# EAGLE design BusPSU (EAGLE 5.12)
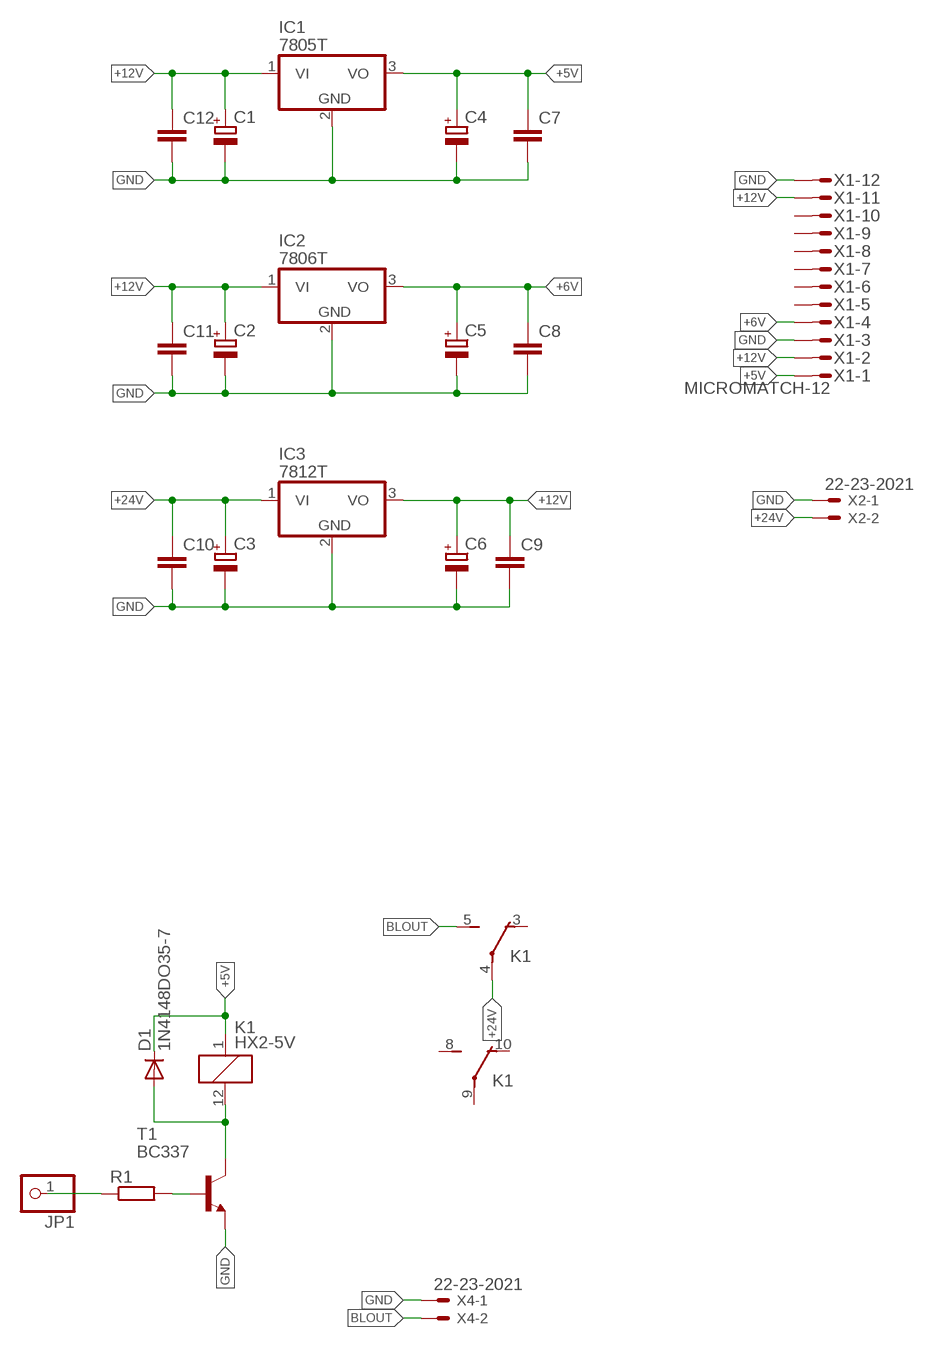
[diagram p0: schematic, sheet 1]

## Parts
C1  CPOL-EUE35-12AXIAL  [E35-12]
C2  CPOL-EUE35-12AXIAL  [E35-12]
C3  CPOL-EUE35-12AXIAL  [E35-12]
C4  CPOL-EUE2-5  [E2-5]
C5  CPOL-EUE2-5  [E2-5]
C6  CPOL-EUE2-5  [E2-5]
C7  C-EU050-025X075  [C050-025X075]
C8  C-EU050-025X075  [C050-025X075]
C9  C-EU050-025X075  [C050-025X075]
C10  C-EU050-025X075  [C050-025X075]
C11  C-EU050-025X075  [C050-025X075]
C12  C-EU050-025X075  [C050-025X075]
D1  1N4148DO35-7  [DO35-7]
IC1  7805T  [TO220H]
IC2  7806T  [TO220H]
IC3  7812T  [TO220H]
JP1  PINHD-1X1  [1X01]
K1  HX2-5V  [HX]
R1  R-EU_0207/10  [0207/10]
T1  BC337  [TO92]
X1  MICROMATCH-12  [MICROMATCH-12]
X2  22-23-2021  [22-23-2021]
X4  22-23-2021  [22-23-2021]

## Nets
+5V: C4.+ C7.1 D1.C IC1.3(VO) K1.1 X1.1
+6V: C5.+ C8.1 IC2.3(VO) X1.4
+12V: C1.+ C2.+ C6.+ C9.1 C11.1 C12.1 IC1.1(VI) IC2.1(VI) IC3.3(VO) X1.2 X1.11
+24V: C3.+ C10.1 IC3.1(VI) K1.4(2:P) X2.2
BLOUT: K1.5(2:S) X4.2
GND: C1.- C2.- C3.- C4.- C5.- C6.- C7.2 C8.2 C9.2 C10.2 C11.2 C12.2 IC1.2(GND) IC2.2(GND) IC3.2(GND) T1.1(E) X1.3 X1.12 X2.1 X4.1
N$1: D1.A K1.12 T1.3(C)
N$3: R1.2 T1.2(B)
N$5: JP1.1 R1.1
Unconnected: K1.3(2:O) K1.8(3:S) K1.9(3:P) K1.10(3:O) X1.5 X1.6 X1.7 X1.8 X1.9 X1.10

## Library data of the parts
C1-C6 = rcl:CPOL-EU: POLARIZED CAPACITOR, European symbol
C7-C12 = rcl:C-EU: CAPACITOR, European symbol
D1 = diode:1N4148: DIODE high speed (Philips)
IC1-IC3 = linear:78*: Positive VOLTAGE REGULATOR Source: http://cache.national.com/ds/LM/LM78L05.pdf http://www.fairchildsemi.com/ds/LM/LM7805.pdf
JP1 = pinhead:PINHD-1X1: PIN HEADER
K1 = relay:HX2-*: Compact & Slim 2 Form C Non-polarized Relay NAiS Source: http://www.mew-europe.com/.. en_ds_61011_0000.pdf; OC_FARNELL: unknown; OC_NEWARK: unknown
R1 = rcl:R-EU_: RESISTOR, European symbol
T1 = transistor:BC337: NPN TRANSISTOR
X1 = con-amp-micromatch:MICROMATCH-12: MicroMaTch 12 8-215464-2 / 1-215464-2 Drawing Number C-215464 DDEController.pdf; MF: FARNELL; MPN: 8-215464-2; OC_FARNELL: 3784666; OC_NEWARK: 95H9857
X2 X4 = con-molex:22-23-2021: .100" (2.54mm) Center Header - 2 Pin; MF: MOLEX; MPN: 22-23-2021; OC_FARNELL: 1462926; OC_NEWARK: 25C3832

## Board
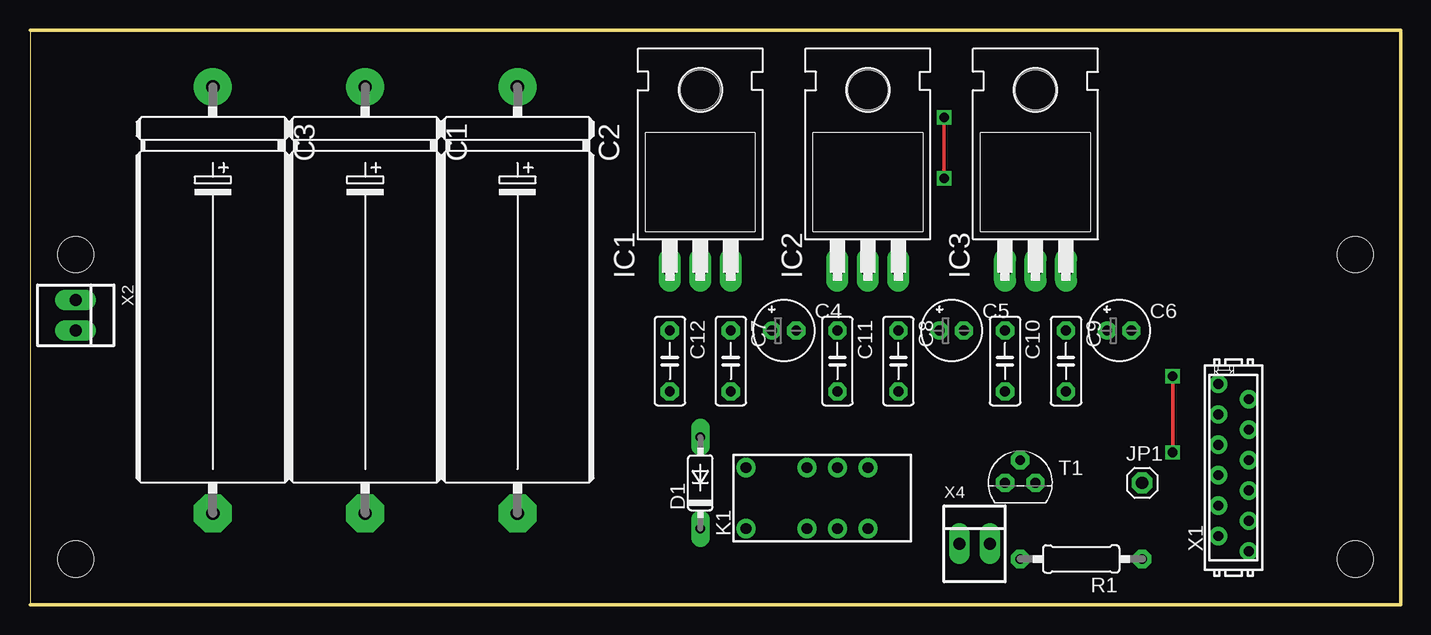
[diagram p1: board, top side]
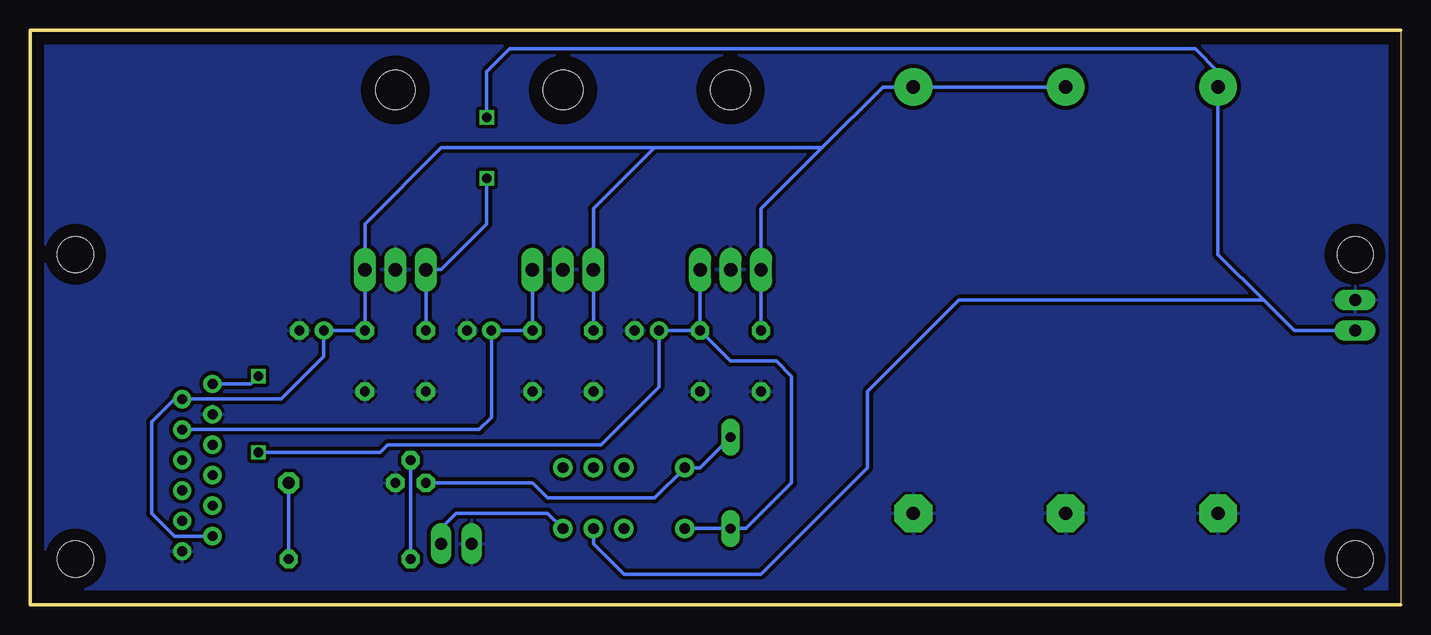
[diagram p2: board, bottom side, seen from below]

Size 114.28 x 47.93 mm. Coordinates in mm from the lower left corner, seen from the top.
Outline: 0,0 114.28,0 114.28,47.93 0,47.93 0,0
Copper layers (1*16): Top 0.035mm / dielectric 1.5mm / Bottom 0.035mm
Design rules "default *": minimum track width 10mil, minimum drill 24mil, track to track 8mil, track to pad 8mil, pad to pad 8mil, via to via 8mil, smd to smd 8mil, copper to edge 40mil, drill to drill 8mil, minimum pad ring 14mil, minimum via ring 8mil, stop-mask expansion 4mil, vias tented up to drill 0mil, thermal gap 10mil
Holes 3 mm at 110.49,29.21 110.49,3.81 3.81,3.81 3.81,29.21

### Footprints (pad centres in the part's own frame; a part is rotated, then mirrored left to right if it is on the bottom)
E35-12 = drill 1.118 pad 3.15 round: + -17.78,0 | drill 1.118 pad 3.15 octagon: - 17.78,0
E2-5 = drill 0.813 pad 1.27 round: + -1.016,0 | drill 0.813 pad 1.27 octagon: - 1.016,0
C050-025X075 = drill 0.813 octagon: 1 -2.54,0; 2 2.54,0
DO35-7 = drill 0.813 long: A 3.81,0; C -3.81,0
TO220H = drill 1.118 long: 1 -2.54,-10.16; 2 0,-10.16; 3 2.54,-10.16 | hole 3.302: 0,4.826
1X01 = drill 1.016 octagon: 1 0,0
HX = drill 0.9 round: 1 -6.35,-2.54; 3 -1.27,-2.54; 4 1.27,-2.54; 5 3.81,-2.54; 8 3.81,2.54; 9 1.27,2.54; 10 -1.27,2.54; 12 -6.35,2.54
0207/10 = drill 0.813 octagon: 1 -5.08,0; 2 5.08,0
TO92 = drill 0.813 octagon: 1 1.27,0; 2 0,1.905; 3 -1.27,0
MICROMATCH-12 = drill 0.813 round: 1 6.985,1.27; 2 5.715,-1.27; 3 4.445,1.27; 4 3.175,-1.27; 5 1.905,1.27; 6 0.635,-1.27; 7 -0.635,1.27; 8 -1.905,-1.27; 9 -3.175,1.27; 10 -4.445,-1.27; 11 -5.715,1.27; 12 -6.985,-1.27
22-23-2021 = drill 1 long: 1 -1.27,0; 2 1.27,0

### Placement (x,y rotation side)
C1  27.94,25.4 270 top
C2  40.64,25.4 270 top
C3  15.24,25.4 270 top
C4  62.87,22.86 0 top
C5  76.83,22.86 0 top
C6  90.81,22.86 0 top
C7  58.42,20.32 270 top
C8  72.39,20.32 270 top
C9  86.36,20.32 270 top
C10  81.28,20.32 270 top
C11  67.31,20.32 270 top
C12  53.34,20.32 270 top
D1  55.88,10.16 90 top
IC1  55.88,38.1 0 top
IC2  69.85,38.1 0 top
IC3  83.82,38.1 0 top
JP1  92.71,10.16 0 top
K1  66.04,8.89 0 top
R1  87.63,3.81 180 top
T1  82.55,10.16 0 top
X1  100.33,11.43 90 top
X2  3.81,24.13 270 top
X4  78.74,5.08 0 top

### Tracks (layer width: path | path; a pad name or v marks a point on that pad's centre or on a via)
+5V  (via drill 0.8)
  Top 0.305: v95.25,12.7 v95.25,19.05
  Bottom 0.305: C7.1 IC1.3 | C7.1 C4.+ 61.85,18.16 66.67,13.34 84.45,13.34 85.09,12.7 v95.25,12.7 | K1.1 D1.C 54.61,6.35 50.8,10.16 50.8,19.05 52.07,20.32 55.88,20.32 C7.1 | X1.1 95.89,18.41 v95.25,19.05
+6V
  Bottom 0.305: IC2.3 C8.1 C5.+ 75.82,15.62 76.83,14.61 X1.4
+12V
  Bottom 0.305: C1.+ C2.+ 43.18,43.18 48.26,38.1 | 48.26,38.1 53.34,33.02 IC1.1 C12.1 | C11.1 IC2.1 67.31,33.02 62.23,38.1 | 48.26,38.1 62.23,38.1 | 62.23,38.1 80.01,38.1 86.36,31.75 IC3.3 C9.1 C6.+ 89.79,20.7 93.34,17.14 X1.2 102.23,17.14 104.14,15.24 104.14,7.62 102.23,5.71 X1.11
+24V  (via drill 0.8)
  Top 0.305: v76.2,40.64 v76.2,35.56
  Bottom 0.305: X2.2 8.89,22.86 11.43,25.4 | 11.43,25.4 15.24,29.21 C3.+ 15.24,44.45 17.14,46.35 74.3,46.35 76.2,44.45 v76.2,40.64 | C10.1 IC3.1 80.01,27.94 76.2,31.75 v76.2,35.56 | K1.4 67.31,5.08 64.77,2.54 53.34,2.54 44.45,11.43 44.45,17.78 36.83,25.4 11.43,25.4
BLOUT
  Bottom 0.305: X4.2 80.01,6.35 78.74,7.62 71.12,7.62 K1.5
GND
  pour Bottom (isolate 0.305): 0,48.26 114.3,48.26 114.3,0 0,0
N$1
  Bottom 0.305: D1.A 58.42,11.43 K1.12 62.23,8.89 71.12,8.89 72.39,10.16 T1.3
N$3
  Bottom 0.305: R1.2 T1.2
N$5
  Bottom 0.305: R1.1 JP1.1